# Altium project Grabber_DIOT.PrjPCB (part 1 of 2)
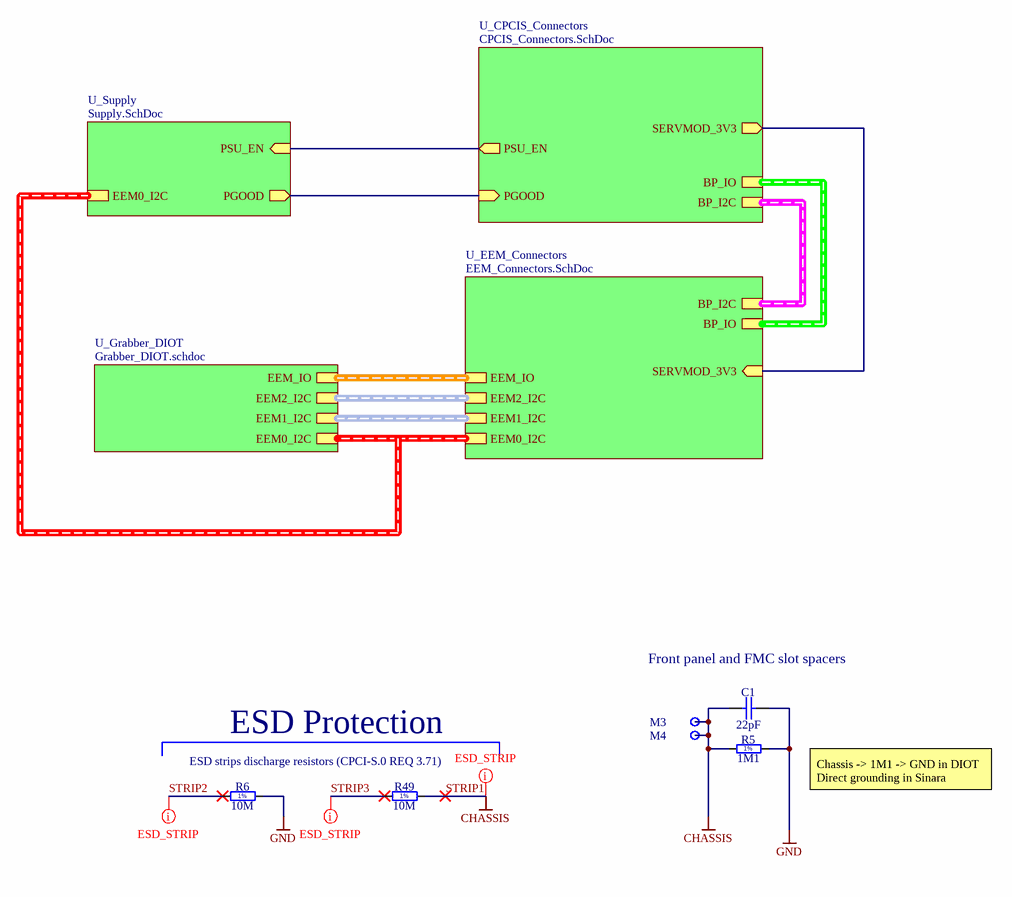
[diagram p0: Grabber_DIOT_TOP.SchDoc]
P_version: 0.1
6 sheets, 234 parts. Net scope: hierarchical (ports join the sheet entries above them; power ports are global).
Board file: Grabber_DIOT.PCBDOC
Sheets:
  Grabber_DIOT_TOP.SchDoc
    U_Grabber_DIOT = Grabber_DIOT.schdoc
      U_LVDS_repeater = LVDS_repeater.SchDoc
      U_LVDS_repeater = LVDS_repeater.SchDoc
      U_LVDS_repeater = LVDS_repeater.SchDoc
      U_LVDS_repeater = LVDS_repeater.SchDoc
      U_LVDS_repeater = LVDS_repeater.SchDoc
      U_LVDS_repeater = LVDS_repeater.SchDoc
      U_LVDS_repeater = LVDS_repeater.SchDoc
      U_LVDS_repeater = LVDS_repeater.SchDoc
      U_LVDS_repeater = LVDS_repeater.SchDoc
      U_LVDS_repeater = LVDS_repeater.SchDoc
      U_LVDS_repeater = LVDS_repeater.SchDoc
      U_LVDS_repeater = LVDS_repeater.SchDoc
      U_LVDS_repeater = LVDS_repeater.SchDoc
      U_LVDS_repeater = LVDS_repeater.SchDoc
      U_LVDS_repeater = LVDS_repeater.SchDoc
      U_LVDS_repeater = LVDS_repeater.SchDoc
      U_LVDS_repeater = LVDS_repeater.SchDoc
      U_LVDS_repeater = LVDS_repeater.SchDoc
      U_LVDS_repeater = LVDS_repeater.SchDoc
      U_LVDS_repeater = LVDS_repeater.SchDoc
      U_LVDS_repeater = LVDS_repeater.SchDoc
    U_CPCIS_Connectors = CPCIS_Connectors.SchDoc
    U_EEM_Connectors = EEM_Connectors.SchDoc
    U_Supply = Supply.SchDoc

## Sheet Grabber_DIOT_TOP.SchDoc: Grabber_DIOT
size 420 x 297 mm; CompanyName: WUT; DrawnBy: MMroz; Organization: WUT; Address1: Warsaw Univeristy of Technology; Address2: Nowowiejska 15/19; Revision: 0.1; SheetNumber: 1; SheetTotal: 5; Title2: TOP

### Parts
C1  22pF  [CAPC1005X55N]
M3  Plated Hole  [MTG300_600]  (value not drawn)  (no BOM)
M4  Plated Hole  [MTG300_600]  (value not drawn)  (no BOM)
R5  1M1  [RESC2012X60N]
R6  10M  [RESC2113X55N]
R49  10M  [RESC2113X55N]

### Sub-sheets
U_CPCIS_Connectors = CPCIS_Connectors.SchDoc: BP_IO (harness BP_LVDS), BP_I2C (harness I2C), SERVMOD_3V3 (out), PSU_EN (out), PGOOD (in)
U_EEM_Connectors = EEM_Connectors.SchDoc: EEM_IO (harness EEM_LVDS), BP_IO (harness BP_LVDS), EEM0_I2C (harness I2C), EEM1_I2C (harness I2C), EEM2_I2C (harness I2C), SERVMOD_3V3 (in), BP_I2C (harness I2C)
U_Grabber_DIOT = Grabber_DIOT.schdoc: EEM_IO (harness EEM_LVDS), EEM0_I2C (harness I2C), EEM1_I2C (harness I2C), EEM2_I2C (harness I2C)
U_Supply = Supply.SchDoc: PSU_EN (in), PGOOD (out), EEM0_I2C (harness I2C)

### Nets
GND: C1.2 R5.2 R6.2
STRIP1: C1.1 M3.1 M4.1 R5.1 R49.2  [also labelled CHASSIS]
PGOOD: sheet U_CPCIS_Connectors/PGOOD, sheet U_Supply/PGOOD
PSU_EN: sheet U_CPCIS_Connectors/PSU_EN, sheet U_Supply/PSU_EN
SERVMOD_3V3: sheet U_CPCIS_Connectors/SERVMOD_3V3, sheet U_EEM_Connectors/SERVMOD_3V3
STRIP2: R6.1
STRIP3: R49.1

### Buses and harness runs
harness sheet U_CPCIS_Connectors/BP_I2C = sheet U_EEM_Connectors/BP_I2C
harness sheet U_CPCIS_Connectors/BP_IO = sheet U_EEM_Connectors/BP_IO
harness sheet U_EEM_Connectors/EEM0_I2C = sheet U_Grabber_DIOT/EEM0_I2C = sheet U_Supply/EEM0_I2C
harness sheet U_EEM_Connectors/EEM1_I2C = sheet U_Grabber_DIOT/EEM1_I2C
harness sheet U_EEM_Connectors/EEM2_I2C = sheet U_Grabber_DIOT/EEM2_I2C
harness sheet U_EEM_Connectors/EEM_IO = sheet U_Grabber_DIOT/EEM_IO

### Layout directives
net class ESD_STRIP: STRIP1, STRIP2, STRIP3

### Notes on the sheet
- Front panel and FMC slot spacers
- ESD strips discharge resistors (CPCI-S.0 REQ 3.71)
- ESD Protection
- Chassis -> 1M1 -> GND in DIOT
  Direct grounding in Sinara
- Project/Equipment
- Document
- Designer
- Drawn by
- Check.by
- Copyright WUT ISE 2024.
  This documentation describes Open Hardware and is licensed under the CERN OHL v.2. You may redistribute and modify this documentation under the terms of the CERN OHL v.2. (http://ohwr.org/CERNOHL). This documentation is distributed WITHOUT ANY EXPRESS OR IMPLIED WARRANTY, INCLUDING OF MERCHANTABILITY, SATISFACTORY QUALITY AND FITNESS FOR A PARTICULAR PURPOSE. Please see the CERN OHL v.2 for applicable conditions.
- Contact
- File
- Last Mod.
- Print Date
- Sheet
- Size
- A3
- of
- Rev
- (in symbol R0805_1M1_1%_0.125W_100PPM) 1%
- (in symbol R0805_10M_1%_0.125W_100PPM_VISHAY_CRCW e3) 1%

### Library data of the parts
C1 = CC0402_22PF_50V_5%_C0G: Non-polarised capacitor; Part Description: SMD Multilayer Chip Ceramic Capacitor; Manufacturer: GENERIC; Manufacturer1 Part Number: C0402C220J5GACTU; Voltage: 50V; TC: C0G/NP0; Tolerance: ±5%; Part Number: CC0402_22PF_50V_5%_C0G; Component Kind: Standard; Component Type: Standard; Pin Count: 2; Value: 22pF; Status: Preferred; Manufacturer Part Number: CC0402_22PF_50V_5%_C0G; Case: 0402; Mounted: Yes; Socket: No; SMD: Yes; Manufacturer1 Example: KEMET; Manufacturer1 ComponentHeight: 0.55mm; HelpURL: \\cern.ch\dfs\Applications\Altium\Datasheets\CC0402_C0G_KEMET_(Commercial Grade).pdf; Author: CERN DEM JLC; CreateDate: 2007-12-03; LatestRevisionDate: 2007-12-03; Sense: No
M3 M4 = PLATED_HOLE3.0_PAD6.0: Single Terminal Socket; Part Description: Plated Through Hole: Hole Dia.=3.0mm Pad Dia.=6.0mm; Mounted: No; Table: Pads; Part Number: PLATED_HOLE3.0_PAD6.0; Component Type: Standard (No BOM); Designator: Single Terminal Socket; Library Reference: Single Terminal Socket; Pin Count: 1; Family: Plated Hole; Socket: No; SMD: No; Status: None; ComponentHeight: 0mm; Author: CERN DEM JLC; CreateDate: 26.05.2008; LatestRevisionDate: 26.05.2008; PackageDescription: Plated Through Hole: Hole Dia.=3.0mm Pad Dia.=6.0mm
R5 = R0805_1M1_1%_0.125W_100PPM: Resistor - 1%; Part Description: General Purpose Thick Film Chip Resistor; Manufacturer: GENERIC; Manufacturer1 Part Number: NRC10F1104TRF; PressFit: No; Part Number: R0805_1M1_1%_0.125W_100PPM; Component Kind: Standard; Component Type: Standard; Pin Count: 2; Value: 1M1; Status: Preferred; Manufacturer Part Number: R0805_1M1_1%_0.125W_100PPM; Case: 0805; Mounted: Yes; Sense: No; Socket: No; SMD: Yes; Manufacturer1 Example: NIC COMPONENT; Manufacturer1 ComponentHeight: 0.6mm; HelpURL: \\cern.ch\dfs\Applications\Altium\Datasheets\R0805_NIC_NRC.pdf; Author: CERN DEM JLC; CreateDate: 03/12/2007; LatestRevisionDate: 13/03/2008
R6 R49 = R0805_10M_1%_0.125W_100PPM_VISHAY_CRCW e3: 150V, Standard Thick Film Chip Resistor; Manufacturer: VISHAY DALE; Manufacturer Part Number: CRCW080510M0FKEA; Power: 0.125W; TC: ±100ppm/°C; Tolerance: ±1%; PressFit: No; Part Number: R0805_10M_1%_0.125W_100PPM; Component Kind: Standard; Component Type: Standard; Pin Count: 2; Value: 10M; Status: None; Part Description: 150V, Standard Thick Film Chip Resistor; Case: 0805; Mounted: Yes; Sense: No; Socket: No; SMD: Yes; ComponentHeight: 0.5mm; HelpURL: \\cern.ch\dfs\Applications\Altium\Datasheets\R0805_VISHAY_CRCW e3.pdf; Author: CERN DEM BC; CreateDate: 2019-11-12; LatestRevisionDate: 2019-11-12

## Sheet Grabber_DIOT.schdoc: Grabber_DIOT
size 420 x 297 mm; Author: G.K.; CompanyName: WUT; DrawnBy: G.K.; Organization: WUT; Address1: Warsaw Univeristy of Technology; Address2: Nowowiejska 15/19; DocumentNumber: 1; Revision: 0.1; SheetNumber: 2; SheetTotal: 5; EDA_Number: ARTIQ; Projet: ARTIQ/Sinara; ModifiedBy: -; CreateDate: -; CheckedDate: -; Title2: Extension board; DivGrp: ISE; Designer: G.K.; ModifiedDate: -; ProjectName: KASLI 3U subsystem
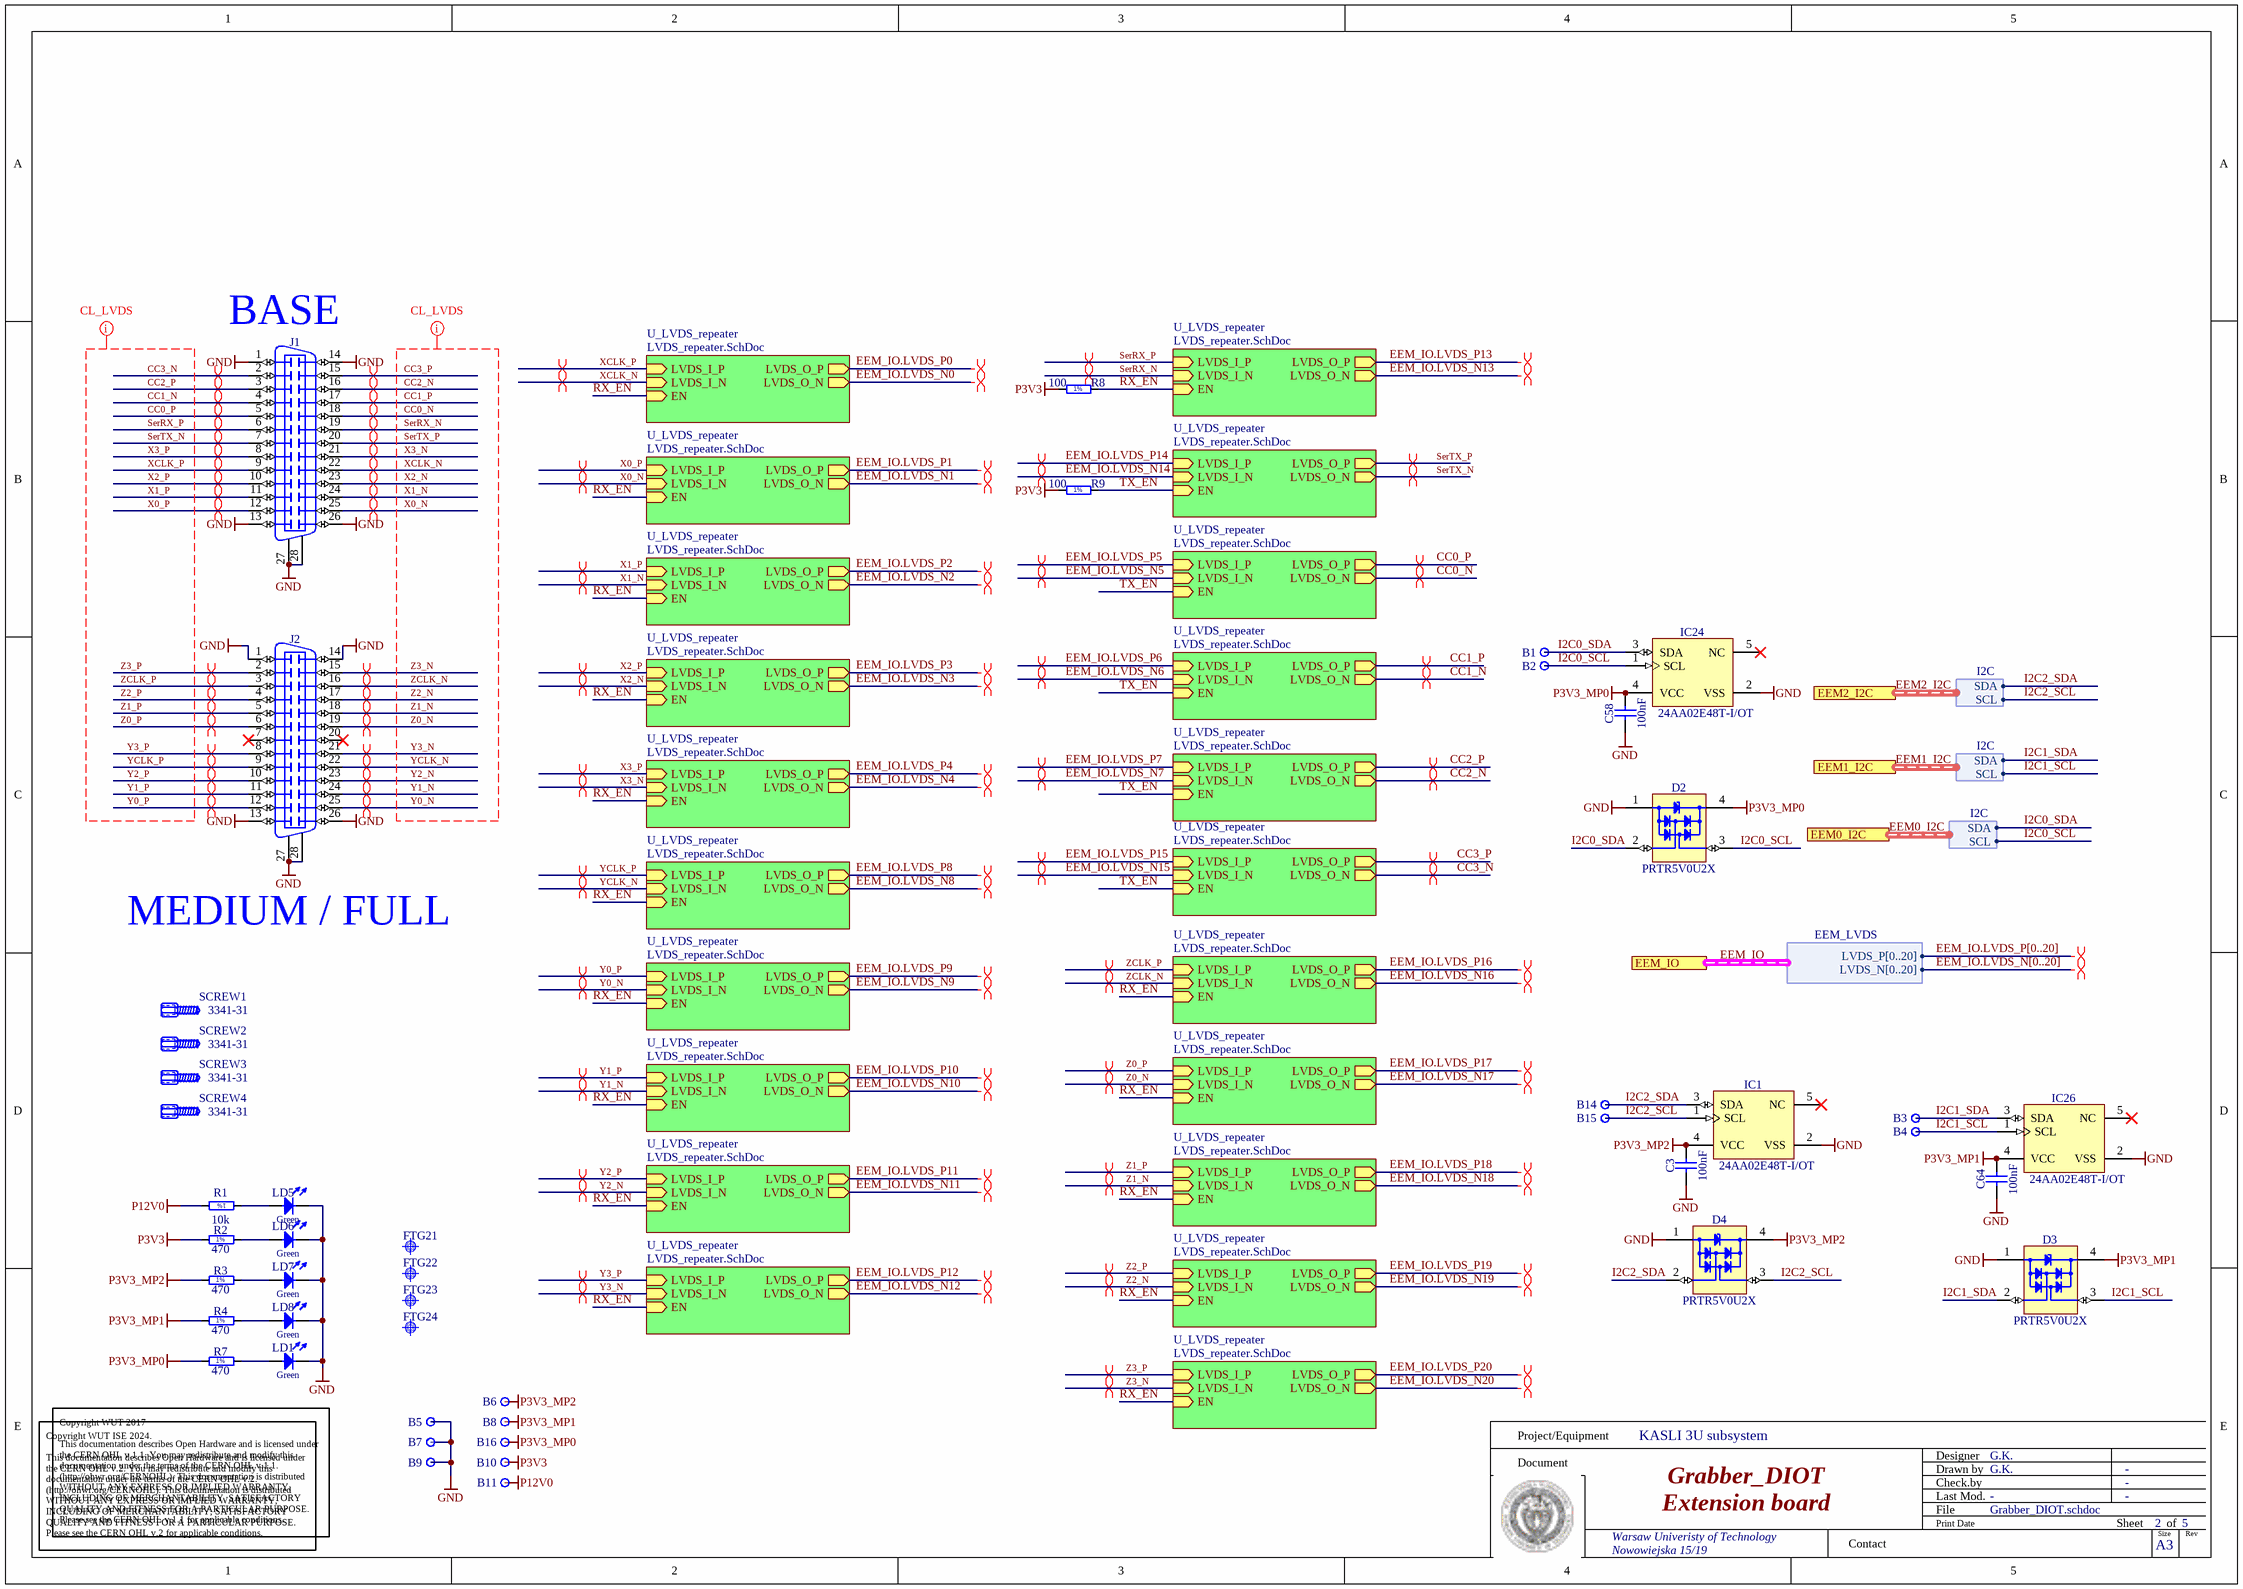
[diagram p1: Grabber_DIOT.schdoc]

### Parts
B1  Plated Hole  [c100h50]  (value not drawn)
B2  Plated Hole  [c100h50]  (value not drawn)
B3  Plated Hole  [c100h50]  (value not drawn)
B4  Plated Hole  [c100h50]  (value not drawn)
B5  Plated Hole  [c100h50]  (value not drawn)
B6  Plated Hole  [c100h50]  (value not drawn)
B7  Plated Hole  [c100h50]  (value not drawn)
B8  Plated Hole  [c100h50]  (value not drawn)
B9  Plated Hole  [c100h50]  (value not drawn)
B10  Plated Hole  [c100h50]  (value not drawn)
B11  Plated Hole  [c100h50]  (value not drawn)
B14  Plated Hole  [c100h50]  (value not drawn)
B15  Plated Hole  [c100h50]  (value not drawn)
B16  Plated Hole  [c100h50]  (value not drawn)
C3  100nF  [CAPC1005X55N]
C58  100nF  [CAPC1005X55N]
C64  100nF  [CAPC1005X55N]
D2  PRTR5V0U2X  [SOT190P230X110-4N]
D3  PRTR5V0U2X  [SOT190P230X110-4N]
D4  PRTR5V0U2X  [SOT190P230X110-4N]
FTG21  Use only in PCB  [FIDUCIAL_TOP_C100-200]  (value not drawn)
FTG22  Use only in PCB  [FIDUCIAL_TOP_S100-200]  (value not drawn)
FTG23  Use only in PCB  [FIDUCIAL_TOP_S200-400]  (value not drawn)
FTG24  Use only in PCB  [FIDUCIAL_TOP_S100-200]  (value not drawn)
IC1  24AA02E48T-I/OT  [SOT95P280X145-5N]
IC24  24AA02E48T-I/OT  [SOT95P280X145-5N]
IC26  24AA02E48T-I/OT  [SOT95P280X145-5N]
J1  N10226-5212PC  [3M_N10226-5212PC]  (value not drawn)
J2  N10226-5212PC  [3M_N10226-5212PC]  (value not drawn)
LD1  Green  [LED_KINGBRIGHT_KP-1608CGCK]  (value not drawn)
LD5  Green  [LED_KINGBRIGHT_KP-1608CGCK]  (value not drawn)
LD6  Green  [LED_KINGBRIGHT_KP-1608CGCK]  (value not drawn)
LD7  Green  [LED_KINGBRIGHT_KP-1608CGCK]  (value not drawn)
LD8  Green  [LED_KINGBRIGHT_KP-1608CGCK]  (value not drawn)
R1  10k  [RESC1005X40N]
R2  470  [RESC1005X40N]
R3  470  [RESC1005X40N]
R4  470  [RESC1005X40N]
R7  470  [RESC1005X40N]
R8  100  [RESC1005X40N]
R9  100  [RESC1005X40N]
SCREW1  3341-31  [3M_3341-31]
SCREW2  3341-31  [3M_3341-31]
SCREW3  3341-31  [3M_3341-31]
SCREW4  3341-31  [3M_3341-31]

### Sub-sheets
U_LVDS_repeater = LVDS_repeater.SchDoc: LVDS_I_P (in), LVDS_I_N (in), LVDS_O_P (out), LVDS_O_N (out), EN (in)
U_LVDS_repeater = LVDS_repeater.SchDoc: LVDS_I_P (in), LVDS_I_N (in), LVDS_O_P (out), LVDS_O_N (out), EN (in)
U_LVDS_repeater = LVDS_repeater.SchDoc: LVDS_I_P (in), LVDS_I_N (in), LVDS_O_P (out), LVDS_O_N (out), EN (in)
U_LVDS_repeater = LVDS_repeater.SchDoc: LVDS_I_P (in), LVDS_I_N (in), LVDS_O_P (out), LVDS_O_N (out), EN (in)
U_LVDS_repeater = LVDS_repeater.SchDoc: LVDS_I_P (in), LVDS_I_N (in), LVDS_O_P (out), LVDS_O_N (out), EN (in)
U_LVDS_repeater = LVDS_repeater.SchDoc: LVDS_I_P (in), LVDS_I_N (in), LVDS_O_P (out), LVDS_O_N (out), EN (in)
U_LVDS_repeater = LVDS_repeater.SchDoc: LVDS_I_P (in), LVDS_I_N (in), LVDS_O_P (out), LVDS_O_N (out), EN (in)
U_LVDS_repeater = LVDS_repeater.SchDoc: LVDS_I_P (in), LVDS_I_N (in), LVDS_O_P (out), LVDS_O_N (out), EN (in)
U_LVDS_repeater = LVDS_repeater.SchDoc: LVDS_I_P (in), LVDS_I_N (in), LVDS_O_P (out), LVDS_O_N (out), EN (in)
U_LVDS_repeater = LVDS_repeater.SchDoc: LVDS_I_P (in), LVDS_I_N (in), LVDS_O_P (out), LVDS_O_N (out), EN (in)
U_LVDS_repeater = LVDS_repeater.SchDoc: LVDS_I_P (in), LVDS_I_N (in), LVDS_O_P (out), LVDS_O_N (out), EN (in)
U_LVDS_repeater = LVDS_repeater.SchDoc: LVDS_I_P (in), LVDS_I_N (in), LVDS_O_P (out), LVDS_O_N (out), EN (in)
U_LVDS_repeater = LVDS_repeater.SchDoc: LVDS_I_P (in), LVDS_I_N (in), LVDS_O_P (out), LVDS_O_N (out), EN (in)
U_LVDS_repeater = LVDS_repeater.SchDoc: LVDS_I_P (in), LVDS_I_N (in), LVDS_O_P (out), LVDS_O_N (out), EN (in)
U_LVDS_repeater = LVDS_repeater.SchDoc: LVDS_I_P (in), LVDS_I_N (in), LVDS_O_P (out), LVDS_O_N (out), EN (in)
U_LVDS_repeater = LVDS_repeater.SchDoc: LVDS_I_P (in), LVDS_I_N (in), LVDS_O_P (out), LVDS_O_N (out), EN (in)
U_LVDS_repeater = LVDS_repeater.SchDoc: LVDS_I_P (in), LVDS_I_N (in), LVDS_O_P (out), LVDS_O_N (out), EN (in)
U_LVDS_repeater = LVDS_repeater.SchDoc: LVDS_I_P (in), LVDS_I_N (in), LVDS_O_P (out), LVDS_O_N (out), EN (in)
U_LVDS_repeater = LVDS_repeater.SchDoc: LVDS_I_P (in), LVDS_I_N (in), LVDS_O_P (out), LVDS_O_N (out), EN (in)
U_LVDS_repeater = LVDS_repeater.SchDoc: LVDS_I_P (in), LVDS_I_N (in), LVDS_O_P (out), LVDS_O_N (out), EN (in)
U_LVDS_repeater = LVDS_repeater.SchDoc: LVDS_I_P (in), LVDS_I_N (in), LVDS_O_P (out), LVDS_O_N (out), EN (in)

### Ports
EEM0_I2C (harness I2C), EEM1_I2C (harness I2C), EEM2_I2C (harness I2C), EEM_IO (harness EEM_LVDS)

### Harnesses
EEM_LVDS: LVDS_P[0..20], LVDS_N[0..20]
I2C: SDA, SCL

### Nets
GND: B5.1 B7.1 B9.1 C3.1 C58.1 C64.1 D2.1(GND) D3.1(GND) D4.1(GND) IC1.2(VSS) IC24.2(VSS) IC26.2(VSS) J1.1 J1.13 J1.14 J1.26 J1.27 J1.28 J2.1 J2.13 J2.14 J2.26 J2.27 J2.28 LD1.1(C) LD5.1(C) LD6.1(C) LD7.1(C) LD8.1(C)
P3V3: B10.1 R2.1 R8.1 R9.1
P3V3_MP0: B16.1 C58.2 D2.4(VCC) IC24.4(VCC) R7.1
P3V3_MP1: B8.1 C64.2 D3.4(VCC) IC26.4(VCC) R4.1
P3V3_MP2: B6.1 C3.2 D4.4(VCC) IC1.4(VCC) R3.1
P12V0: B11.1 R1.2
CC0_N: J1.18 ; sheet U_LVDS_repeater/LVDS_O_N
CC0_P: J1.5 ; sheet U_LVDS_repeater/LVDS_O_P
CC1_N: J1.4 ; sheet U_LVDS_repeater/LVDS_O_N
CC1_P: J1.17 ; sheet U_LVDS_repeater/LVDS_O_P
CC2_N: J1.16 ; sheet U_LVDS_repeater/LVDS_O_N
CC2_P: J1.3 ; sheet U_LVDS_repeater/LVDS_O_P
CC3_N: J1.2 ; sheet U_LVDS_repeater/LVDS_O_N
CC3_P: J1.15 ; sheet U_LVDS_repeater/LVDS_O_P
I2C0_SCL: B2.1 D2.3(I/O2) IC24.1(SCL) ; port EEM0_I2C.SCL  [project net EEM0_I2C.SCL]
I2C0_SDA: B1.1 D2.2(I/O1) IC24.3(SDA) ; port EEM0_I2C.SDA  [project net EEM0_I2C.SDA]
I2C1_SCL: B4.1 D3.3(I/O2) IC26.1(SCL) ; port EEM1_I2C.SCL  [project net EEM1_I2C.SCL]
I2C1_SDA: B3.1 D3.2(I/O1) IC26.3(SDA) ; port EEM1_I2C.SDA  [project net EEM1_I2C.SDA]
I2C2_SCL: B15.1 D4.3(I/O2) IC1.1(SCL) ; port EEM2_I2C.SCL  [project net EEM2_I2C.SCL]
I2C2_SDA: B14.1 D4.2(I/O1) IC1.3(SDA) ; port EEM2_I2C.SDA  [project net EEM2_I2C.SDA]
RX_EN: R8.2 ; sheet U_LVDS_repeater/EN, sheet U_LVDS_repeater/EN, sheet U_LVDS_repeater/EN, sheet U_LVDS_repeater/EN, sheet U_LVDS_repeater/EN, sheet U_LVDS_repeater/EN, sheet U_LVDS_repeater/EN, sheet U_LVDS_repeater/EN, sheet U_LVDS_repeater/EN, sheet U_LVDS_repeater/EN, sheet U_LVDS_repeater/EN, sheet U_LVDS_repeater/EN, sheet U_LVDS_repeater/EN, sheet U_LVDS_repeater/EN, sheet U_LVDS_repeater/EN, sheet U_LVDS_repeater/EN
SerRX_N: J1.19 ; sheet U_LVDS_repeater/LVDS_I_N
SerRX_P: J1.6 ; sheet U_LVDS_repeater/LVDS_I_P
SerTX_N: J1.7 ; sheet U_LVDS_repeater/LVDS_O_N
SerTX_P: J1.20 ; sheet U_LVDS_repeater/LVDS_O_P
TX_EN: R9.2 ; sheet U_LVDS_repeater/EN, sheet U_LVDS_repeater/EN, sheet U_LVDS_repeater/EN, sheet U_LVDS_repeater/EN, sheet U_LVDS_repeater/EN
X0_N: J1.25 ; sheet U_LVDS_repeater/LVDS_I_N
X0_P: J1.12 ; sheet U_LVDS_repeater/LVDS_I_P
X1_N: J1.24 ; sheet U_LVDS_repeater/LVDS_I_N
X1_P: J1.11 ; sheet U_LVDS_repeater/LVDS_I_P
X2_N: J1.23 ; sheet U_LVDS_repeater/LVDS_I_N
X2_P: J1.10 ; sheet U_LVDS_repeater/LVDS_I_P
X3_N: J1.21 ; sheet U_LVDS_repeater/LVDS_I_N
X3_P: J1.8 ; sheet U_LVDS_repeater/LVDS_I_P
XCLK_N: J1.22 ; sheet U_LVDS_repeater/LVDS_I_N
XCLK_P: J1.9 ; sheet U_LVDS_repeater/LVDS_I_P
Y0_N: J2.25 ; sheet U_LVDS_repeater/LVDS_I_N
Y0_P: J2.12 ; sheet U_LVDS_repeater/LVDS_I_P
Y1_N: J2.24 ; sheet U_LVDS_repeater/LVDS_I_N
Y1_P: J2.11 ; sheet U_LVDS_repeater/LVDS_I_P
Y2_N: J2.23 ; sheet U_LVDS_repeater/LVDS_I_N
Y2_P: J2.10 ; sheet U_LVDS_repeater/LVDS_I_P
Y3_N: J2.21 ; sheet U_LVDS_repeater/LVDS_I_N
Y3_P: J2.8 ; sheet U_LVDS_repeater/LVDS_I_P
YCLK_N: J2.22 ; sheet U_LVDS_repeater/LVDS_I_N
YCLK_P: J2.9 ; sheet U_LVDS_repeater/LVDS_I_P
Z0_N: J2.19 ; sheet U_LVDS_repeater/LVDS_I_N
Z0_P: J2.6 ; sheet U_LVDS_repeater/LVDS_I_P
Z1_N: J2.18 ; sheet U_LVDS_repeater/LVDS_I_N
Z1_P: J2.5 ; sheet U_LVDS_repeater/LVDS_I_P
Z2_N: J2.17 ; sheet U_LVDS_repeater/LVDS_I_N
Z2_P: J2.4 ; sheet U_LVDS_repeater/LVDS_I_P
Z3_N: J2.15 ; sheet U_LVDS_repeater/LVDS_I_N
Z3_P: J2.2 ; sheet U_LVDS_repeater/LVDS_I_P
ZCLK_N: J2.16 ; sheet U_LVDS_repeater/LVDS_I_N
ZCLK_P: J2.3 ; sheet U_LVDS_repeater/LVDS_I_P
NetLD1_2: LD1.2(A) R7.2
NetLD5_2: LD5.2(A) R1.1
NetLD6_2: LD6.2(A) R2.2
NetLD7_2: LD7.2(A) R3.2
NetLD8_2: LD8.2(A) R4.2

Not connected (* = marked no-connect by the designer): IC1 5(NC)*; IC24 5(NC)*; IC26 5(NC)*; J2 7* 20*

### Buses and harness runs
bus EEM_IO.LVDS_N[0..20]
bus EEM_IO.LVDS_P[0..20]
harness EEM0_I2C = port EEM0_I2C
harness EEM1_I2C = port EEM1_I2C
harness EEM2_I2C = port EEM2_I2C
harness EEM_IO = port EEM_IO

### Layout directives
differential pair: CC0_N, CC0_P, CC1_N, CC1_P, CC2_N, CC2_P, CC3_N, CC3_P, EEM_IO.LVDS_N0, EEM_IO.LVDS_N1, EEM_IO.LVDS_N2, EEM_IO.LVDS_N3, EEM_IO.LVDS_N4, EEM_IO.LVDS_N5, EEM_IO.LVDS_N6, EEM_IO.LVDS_N7, EEM_IO.LVDS_N8, EEM_IO.LVDS_N9, EEM_IO.LVDS_N10, EEM_IO.LVDS_N11, EEM_IO.LVDS_N12, EEM_IO.LVDS_N13, EEM_IO.LVDS_N14, EEM_IO.LVDS_N15, EEM_IO.LVDS_N16, EEM_IO.LVDS_N17, EEM_IO.LVDS_N18, EEM_IO.LVDS_N19, EEM_IO.LVDS_N20, EEM_IO.LVDS_P0, EEM_IO.LVDS_P1, EEM_IO.LVDS_P2, EEM_IO.LVDS_P3, EEM_IO.LVDS_P4, EEM_IO.LVDS_P5, EEM_IO.LVDS_P6, EEM_IO.LVDS_P7, EEM_IO.LVDS_P8, EEM_IO.LVDS_P9, EEM_IO.LVDS_P10, EEM_IO.LVDS_P11, EEM_IO.LVDS_P12, EEM_IO.LVDS_P13, EEM_IO.LVDS_P14, EEM_IO.LVDS_P15, EEM_IO.LVDS_P16, EEM_IO.LVDS_P17, EEM_IO.LVDS_P18, EEM_IO.LVDS_P19, EEM_IO.LVDS_P20, SerRX_N, SerRX_P, SerTX_N, SerTX_P, X0_N, X0_P, X1_N, X1_P, X2_N, X2_P, X3_N, X3_P, XCLK_N, XCLK_P, Y0_N, Y0_P, Y1_N, Y1_P, Y2_N, Y2_P, Y3_N, Y3_P, YCLK_N, YCLK_P, Z0_N, Z0_P, Z1_N, Z1_P, Z2_N, Z2_P, Z3_N, Z3_P, ZCLK_N, ZCLK_P
net class CL_LVDS: CC0_N, CC0_P, CC1_N, CC1_P, CC2_N, CC2_P, CC3_N, CC3_P, SerRX_N, SerRX_P, SerTX_N, SerTX_P, X0_N, X0_P, X1_N, X1_P, X2_N, X2_P, X3_N, X3_P, XCLK_N, XCLK_P, Y0_N, Y0_P, Y1_N, Y1_P, Y2_N, Y2_P, Y3_N, Y3_P, YCLK_N, YCLK_P, Z0_N, Z0_P, Z1_N, Z1_P, Z2_N, Z2_P, Z3_N, Z3_P, ZCLK_N, ZCLK_P
differential pair; differential pair class Diff_100Ohm: (no net found under the mark)

### Notes on the sheet
- (near J1) BASE
- MEDIUM / FULL
- Copyright WUT 2017
  This documentation describes Open Hardware and is licensed under the CERN OHL v.1.1. You may redistribute and modify this documentation under the terms of the CERN OHL v.1.1. (http://ohwr.org/CERNOHL). This documentation is distributed WITHOUT ANY EXPRESS OR IMPLIED WARRANTY, INCLUDING OF MERCHANTABILITY, SATISFACTORY QUALITY AND FITNESS FOR A PARTICULAR PURPOSE. Please see the CERN OHL v.1.1 for applicable conditions.
- Project/Equipment
- Document
- Designer
- Drawn by
- Check.by
- Copyright WUT ISE 2024.
  This documentation describes Open Hardware and is licensed under the CERN OHL v.2. You may redistribute and modify this documentation under the terms of the CERN OHL v.2. (http://ohwr.org/CERNOHL). This documentation is distributed WITHOUT ANY EXPRESS OR IMPLIED WARRANTY, INCLUDING OF MERCHANTABILITY, SATISFACTORY QUALITY AND FITNESS FOR A PARTICULAR PURPOSE. Please see the CERN OHL v.2 for applicable conditions.
- Contact
- File
- Last Mod.
- Print Date
- Sheet
- Size
- A3
- of
- Rev
- (in symbol R0402_10K_1%_0.0625W_100PPM) 1%
- (in symbol R0402_100R_1%_0.1W_100PPM) 1%
- (in symbol R0402_470R_1%_0.0625W_100PPM) 1%

### Library data of the parts
B1-B11 B14-B16 = PLATED_HOLE0.6_PAD1.3: Single Terminal Socket; Part Description: Plated Through Hole: Hole Dia.=0.6mm Pad Dia.=1.3mm; Mounted: No; Part Number: PLATED_HOLE0.6_PAD1.3; Component Kind: Standard (No BOM); Component Type: Standard (No BOM); Footprint: c130h60; Pin Count: 1; Family: Plated Hole; Socket: No; SMD: No; Sense: No; Status: None; ComponentHeight: 0mm; HelpURL: Undefined; Author: CERN DEM MR; CreateDate: 02.03.2016; LatestRevisionDate: 02.03.2016; PackageDescription: Plated Through Hole: Hole Dia.=0.6mm Pad Dia.=1.3mm
C3 C58 C64 = CC0402_100NF_16V_10%_X5R: Non-polarised capacitor; Part Description: SMD Multilayer Chip Ceramic Capacitor; Manufacturer: GENERIC; Manufacturer1 Part Number: GRM155R61C104KA88D; Voltage: 16V; TC: X5R; Tolerance: ±10%; Part Number: CC0402_100NF_16V_10%_X5R; Component Kind: Standard; Component Type: Standard; Pin Count: 2; Value: 100nF; Status: None; Manufacturer Part Number: CC0402_100NF_16V_10%_X5R; Case: 0402; Mounted: Yes; Socket: No; SMD: Yes; Sense: No; Manufacturer1 Example: MURATA; Manufacturer1 ComponentHeight: 0.55mm; HelpURL: \\cern.ch\dfs\Applications\Altium\Datasheets\CC0402_X5R_MURATA_GRM.pdf; Author: CERN DEM JLC; CreateDate: 10.12.2013; LatestRevisionDate: 10.12.2013
D2-D4 = PRTR5V0U2X: Ultra Low Capacitance Double Rail-to-Rail ESD Protection Diode; Part Description: Ultra Low Capacitance (1pF) Double Rail-to-Rail ESD Protection Diode (8kV); Manufacturer: NXP SEMICONDUCTORS; Voltage: 5.5V; PressFit: No; Bonding: No; Part Number: PRTR5V0U2X; Component Kind: Standard; Component Type: Standard; Device: PRTR5V0U2X; PackageDescription: SOT143B, SOT, 1.90mm Pitch; 4 Pin, 1.30mm W X 2.90mm L X 1.10mm H body, IPC Medium Density; Manufacturer Part Number: PRTR5V0U2X; Pin Count: 4; Case: SOT143B; Mounted: Yes; Socket: No; SMD: Yes; Sense: No; ComponentHeight: 1.1mm; HelpURL: \\cern.ch\dfs\Applications\Altium\Datasheets\PRTR5V0U2X.pdf; Author: CERN DEM JLC; CreateDate: 22.03.2011; LatestRevisionDate: 22.03.2011
FTG21 = FIDUCIAL_TARGET_C100-200: Fiducial Target; Part Description: Round Fiducial Target, Top Layer, 1.0mm, Top Solder 2.0mm, Keepout =2.0mm; Mounted: No; Part Number: FIDUCIAL_TARGET_C100-200; Component Kind: Standard (No BOM); Component Type: Standard (No BOM); Pin Count: 1; Family: Fiducial; Socket: No; SMD: Yes; Sense: No; Status: None; ComponentHeight: 0mm; HelpURL: Undefined; Author: CERN DEM JLC; CreateDate: 09.02.2010; LatestRevisionDate: 04.04.2012; PackageDescription: Round Fiducial Target, Top Layer, 1.0mm, Top Solder 2.0mm, Keepout =2.0mm
FTG22 FTG24 = FIDUCIAL_TARGET_S100-200: Fiducial Target; Part Description: Square Fiducial Target, Top Layer, 1.0mm, Top Solder 2.0mm, Keepout =2.0mm; Mounted: No; Part Number: FIDUCIAL_TARGET_S100-200; Component Kind: Standard (No BOM); Component Type: Standard (No BOM); Pin Count: 1; Family: Fiducial; Socket: No; SMD: Yes; Sense: No; Status: None; ComponentHeight: 0mm; HelpURL: Undefined; Author: CERN DEM JLC; CreateDate: 09.02.2010; LatestRevisionDate: 04.04.2012; PackageDescription: Square Fiducial Target, Top Layer, 1.0mm, Top Solder 2.0mm, Keepout =2.0mm
FTG23 = FIDUCIAL_TARGET_S200-400: Fiducial Target; Part Description: Square Fiducial Target, Top Layer, 2.0mm, Top Solder 4.0mm, Keepout =4.0mm; Mounted: No; Part Number: FIDUCIAL_TARGET_S200-400; Component Kind: Standard (No BOM); Component Type: Standard (No BOM); Pin Count: 1; Family: Fiducial; Socket: No; SMD: Yes; Sense: No; Status: None; ComponentHeight: 0mm; HelpURL: Undefined; Author: CERN DEM JLC; CreateDate: 02.06.2008; LatestRevisionDate: 04.04.2012; PackageDescription: Square Fiducial Target, Top Layer, 2.0mm, Top Solder 4.0mm, Keepout =4.0mm
IC1 IC24 IC26 = 24AA02E48T-I/OT: 1.7V-5.5V, 2K I2C Serial EEPROM With EUI-48 Node Identity; Manufacturer: MICROCHIP TECHNOLOGY; PressFit: No; Bonding: No; Part Number: 24AA02E48T-I/OT; Component Kind: Standard; Component Type: Standard; Device: 24AA02E48T-I/OT; PackageDescription: SOT, 0.95mm pitch; 5 pin, 1.60mm W X 2.90mm L X 1.45mm H body, IPC Medium Density; Part Description: 1.7V-5.5V, 2K I2C Serial EEPROM With EUI-48 Node Identity; Manufacturer Part Number: 24AA02E48T-I/OT; Pin Count: 5; Case: SOT23-5; Mounted: Yes; Socket: No; SMD: Yes; Sense: No; ComponentHeight: 1.45mm; HelpURL: \\cern.ch\dfs\Applications\Altium\Datasheets\24AA02E48T-I-OT.pdf; Author: CERN DEM MR; CreateDate: 31.03.2016; LatestRevisionDate: 31.03.2016
J1 J2 = 3M_N10226-5212PC: Connector Mini D Ribbon (MDR) 26 Female; Part Description: 26 contacts, Mini D Ribbon (MDR), .050" Boardmount Through-hole Right Angle Receptacle-Shielded, Diecast Body, 102 Series; Manufacturer: 3M; PressFit: No; Part Number: N10226-5212PC; Component Kind: Standard; Component Type: Standard; Footprint: MDR 26; Pin Count: 28; Family: MDR 26; Mounted: Yes; Socket: No; SMD: No; Sense: No; Status: None; Manufacturer Part Number: N10226-5212PC; ComponentHeight: 9.4mm; HelpURL: \\cern.ch\dfs\Applications\Altium\Datasheets\3M_N10226-5212PC.pdf; Author: CERN DEM JLC; CreateDate: 18.11.2008; LatestRevisionDate: 14.10.2009
LD1 LD5-LD8 = LED_KINGBRIGHT_KPH-1608CGCK: LED Green 1C 2A; Part Description: SMD Green LED, Case 1.6mmX0.8mm(0603), 0.65mm Thickness; PressFit: No; Bonding: No; Part Number: KPH-1608CGCK; Component Kind: Standard; Component Type: Standard; Color: Green; Footprint: LED_KINGBRIGHT_KPH-1608CGCK; PackageDescription: SMT Green LED, Case 0603, Body L 1.6 x W 0.8mm H 0.65mm; Manufacturer: KINGBRIGHT; Manufacturer Part Number: KPH-1608CGCK; Pin Count: 2; Mounted: Yes; Socket: No; SMD: Yes; Sense: No; ComponentHeight: 0.65mm; HelpURL: \\cern.ch\dfs\Applications\Altium\Datasheets\LED_KINGBRIGHT_KPH-1608CGCK.pdf; Author: CERN DEM JLC; CreateDate: 03.07.2017; LatestRevisionDate: 03.07.2017
R1 = R0402_10K_1%_0.0625W_100PPM: Resistor - 1%; Part Description: General Purpose Thick Film Chip Resistor; Manufacturer: GENERIC; Manufacturer1 Part Number: 232270671003L; TC: ±100ppm/°C; Part Number: R0402_10K_1%_0.0625W_100PPM; Component Kind: Standard; Component Type: Standard; Pin Count: 2; Value: 10k; Status: Not recommended; Power: 0.0625W; Tolerance: ±1%; Manufacturer Part Number: R0402_10K_1%_0.0625W_100PPM; Case: 0402; Mounted: Yes; Sense: No; Socket: No; SMD: Yes; Manufacturer1 Example: YAGEO PHYCOMP; Manufacturer1 ComponentHeight: 0.4mm; HelpURL: \\cern.ch\dfs\Applications\Altium\Datasheets\R0402_Phycomp_RC0402.pdf; Author: CERN DEM JLC; CreateDate: 03.12.2007; LatestRevisionDate: 17.10.2012
R2-R4 R7 = R0402_470R_1%_0.0625W_100PPM: Resistor - 1%; Part Description: General Purpose Thick Film Chip Resistor; Manufacturer: GENERIC; Manufacturer1 Part Number: 232270674701L; TC: ±100ppm/°C; PressFit: No; Part Number: R0402_470R_1%_0.0625W_100PPM; Component Kind: Standard; Component Type: Standard; Pin Count: 2; Value: 470; Status: Not Recommended; Power: 0.0625W; Tolerance: ±1%; Manufacturer Part Number: R0402_470R_1%_0.0625W_100PPM; Case: 0402; Mounted: Yes; Sense: No; Socket: No; SMD: Yes; Manufacturer1 Example: YAGEO PHYCOMP; Manufacturer1 ComponentHeight: 0.4mm; HelpURL: \\cern.ch\dfs\Applications\Altium\Datasheets\R0402_Phycomp_RC0402.pdf; Author: CERN DEM JLC; CreateDate: 03.12.2007; LatestRevisionDate: 17.10.2012
R8 R9 = R0402_100R_1%_0.1W_100PPM: Resistor - 1%; Part Description: General Purpose Thick Film Chip Resistor; Manufacturer: GENERIC; Manufacturer Part Number: R0402_100R_1%_0.1W_100PPM_50V; Manufacturer1 Part Number: ERJ2RKF1000X; Power: 0.1W; TC: ±100ppm/°C; Voltage: 50V; Part Number: R0402_100R_1%_0.1W_100PPM; Component Kind: Standard; Component Type: Standard; Pin Count: 2; Value: 100; Status: Not recommended; Tolerance: ±1%; Case: 0402; Mounted: Yes; Sense: No; Socket: No; SMD: Yes; Manufacturer1 Example: PANASONIC; Manufacturer1 ComponentHeight: 0.4mm; HelpURL: \\cern.ch\dfs\Applications\Altium\Datasheets\R0402_PANASONIC_ERJ2RK.pdf; Author: CERN DEM JLC; CreateDate: 12.12.2013; LatestRevisionDate: 03.03.2015
SCREW1-SCREW4 = MECH_MDR_screw_lock: VHDCI Female Screw Lock; Part Description: MDR Female Screw Locks, Thread Size: M2.5; Manufacturer: 3M; PressFit: No; Part Number: 3341-31; Component Kind: Standard; Component Type: Mechanical; Pin Count: 0; PackageDescription: MDR Female Screw Locks, Thread Size: M2.5; Mounted: Yes; Socket: No; SMD: No; Sense: No; Status: None; Value: 3341-31; Manufacturer Part Number: 3341-31; ComponentHeight: 5.48mm; HelpURL: \\cern.ch\dfs\Applications\Altium\Datasheets\TYCO_749087-2.pdf; Author: GK; CreateDate: 10.09.2013; LatestRevisionDate: 10.09.2013

## Sheet LVDS_repeater.SchDoc: SIngle channel
size 420 x 297 mm; Author: G.K.; CompanyName: WUT; DrawnBy: G.K.; Organization: CERN; Address1: Warsaw Univeristy of Technology; Address2: Nowowiejska 15/19; Revision: 0.1; SheetNumber: 3; SheetTotal: 5; EDA_Number: ARTIQ; Projet: Gerber; ModifiedBy: -; CreateDate: -; CheckedDate: -; Title2: LVDS repeater; DivGrp: ISE; Designer: G.K.; ModifiedDate: -; ProjectName: KASLI 3U subsystem
Used 21 times, as channels U_Grabber_DIOT/U_LVDS_repeater, U_Grabber_DIOT/U_LVDS_repeater, U_Grabber_DIOT/U_LVDS_repeater, U_Grabber_DIOT/U_LVDS_repeater, U_Grabber_DIOT/U_LVDS_repeater, U_Grabber_DIOT/U_LVDS_repeater, U_Grabber_DIOT/U_LVDS_repeater, U_Grabber_DIOT/U_LVDS_repeater, U_Grabber_DIOT/U_LVDS_repeater, U_Grabber_DIOT/U_LVDS_repeater, U_Grabber_DIOT/U_LVDS_repeater, U_Grabber_DIOT/U_LVDS_repeater, U_Grabber_DIOT/U_LVDS_repeater, U_Grabber_DIOT/U_LVDS_repeater, U_Grabber_DIOT/U_LVDS_repeater, U_Grabber_DIOT/U_LVDS_repeater, U_Grabber_DIOT/U_LVDS_repeater, U_Grabber_DIOT/U_LVDS_repeater, U_Grabber_DIOT/U_LVDS_repeater, U_Grabber_DIOT/U_LVDS_repeater, U_Grabber_DIOT/U_LVDS_repeater. Parts and nets are listed once, with the designators drawn on the sheet.
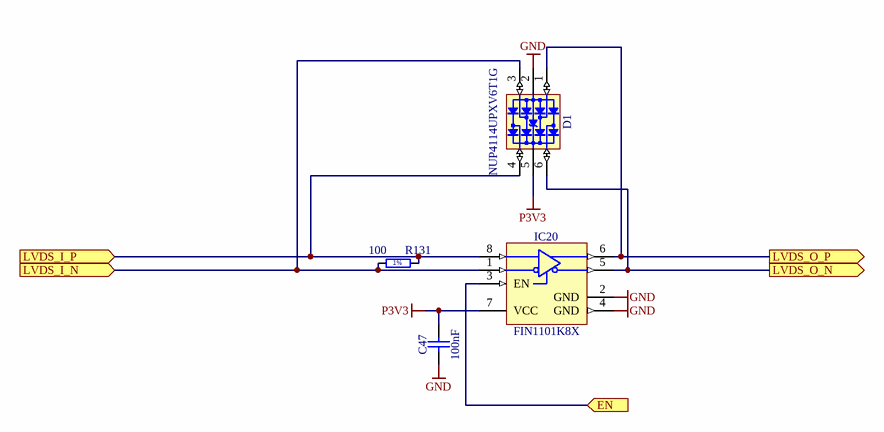
[diagram p2: LVDS_repeater.SchDoc]

### Parts
C47  100nF  [CAPC1005X55N]
D1  NUP4114UPXV6T1G  [SOTFL50P160X60-6N]
IC20  FIN1101K8X  [SOP50P310X90-8N]
R131  100  [RESC1005X40N]

### Ports
EN (in), LVDS_I_N (in), LVDS_I_P (in), LVDS_O_N (out), LVDS_O_P (out)

### Nets
GND: C47.1 D1.2(GND) IC20.2(GND) IC20.4(GND)
P3V3: C47.2 D1.5(VBUS) IC20.7(VCC)
EN: IC20.3(EN) ; port EN
LVDS_I_N: D1.3(I/O2) IC20.1(RIN-) R131.1 ; port LVDS_I_N
LVDS_I_P: D1.4(I/O3) IC20.8(RIN+) R131.2 ; port LVDS_I_P
LVDS_O_N: D1.6(I/O4) IC20.5(DOUT-) ; port LVDS_O_N
LVDS_O_P: D1.1(I/O1) IC20.6(DOUT+) ; port LVDS_O_P

### Channels
U_Grabber_DIOT/U_LVDS_repeater: designators end in U; ports EN=RX_EN LVDS_I_N=XCLK_N LVDS_I_P=XCLK_P LVDS_O_N=EEM_IO.LVDS_N0 LVDS_O_P=EEM_IO.LVDS_P0
U_Grabber_DIOT/U_LVDS_repeater: designators end in T; ports EN=RX_EN LVDS_I_N=X0_N LVDS_I_P=X0_P LVDS_O_N=EEM_IO.LVDS_N1 LVDS_O_P=EEM_IO.LVDS_P1
U_Grabber_DIOT/U_LVDS_repeater: designators end in S; ports EN=RX_EN LVDS_I_N=X1_N LVDS_I_P=X1_P LVDS_O_N=EEM_IO.LVDS_N2 LVDS_O_P=EEM_IO.LVDS_P2
U_Grabber_DIOT/U_LVDS_repeater: designators end in R; ports EN=RX_EN LVDS_I_N=X2_N LVDS_I_P=X2_P LVDS_O_N=EEM_IO.LVDS_N3 LVDS_O_P=EEM_IO.LVDS_P3
U_Grabber_DIOT/U_LVDS_repeater: designators end in Q; ports EN=RX_EN LVDS_I_N=X3_N LVDS_I_P=X3_P LVDS_O_N=EEM_IO.LVDS_N4 LVDS_O_P=EEM_IO.LVDS_P4
U_Grabber_DIOT/U_LVDS_repeater: designators end in P; ports EN=RX_EN LVDS_I_N=YCLK_N LVDS_I_P=YCLK_P LVDS_O_N=EEM_IO.LVDS_N8 LVDS_O_P=EEM_IO.LVDS_P8
U_Grabber_DIOT/U_LVDS_repeater: designators end in O; ports EN=RX_EN LVDS_I_N=Y0_N LVDS_I_P=Y0_P LVDS_O_N=EEM_IO.LVDS_N9 LVDS_O_P=EEM_IO.LVDS_P9
U_Grabber_DIOT/U_LVDS_repeater: designators end in N; ports EN=RX_EN LVDS_I_N=Y1_N LVDS_I_P=Y1_P LVDS_O_N=EEM_IO.LVDS_N10 LVDS_O_P=EEM_IO.LVDS_P10
U_Grabber_DIOT/U_LVDS_repeater: designators end in M; ports EN=RX_EN LVDS_I_N=Y2_N LVDS_I_P=Y2_P LVDS_O_N=EEM_IO.LVDS_N11 LVDS_O_P=EEM_IO.LVDS_P11
U_Grabber_DIOT/U_LVDS_repeater: designators end in L; ports EN=RX_EN LVDS_I_N=Y3_N LVDS_I_P=Y3_P LVDS_O_N=EEM_IO.LVDS_N12 LVDS_O_P=EEM_IO.LVDS_P12
U_Grabber_DIOT/U_LVDS_repeater: designators end in K; ports EN=RX_EN LVDS_I_N=SerRX_N LVDS_I_P=SerRX_P LVDS_O_N=EEM_IO.LVDS_N13 LVDS_O_P=EEM_IO.LVDS_P13
U_Grabber_DIOT/U_LVDS_repeater: designators end in J; ports EN=TX_EN LVDS_I_N=EEM_IO.LVDS_N14 LVDS_I_P=EEM_IO.LVDS_P14 LVDS_O_N=SerTX_N LVDS_O_P=SerTX_P
U_Grabber_DIOT/U_LVDS_repeater: designators end in I; ports EN=TX_EN LVDS_I_N=EEM_IO.LVDS_N5 LVDS_I_P=EEM_IO.LVDS_P5 LVDS_O_N=CC0_N LVDS_O_P=CC0_P
U_Grabber_DIOT/U_LVDS_repeater: designators end in H; ports EN=TX_EN LVDS_I_N=EEM_IO.LVDS_N6 LVDS_I_P=EEM_IO.LVDS_P6 LVDS_O_N=CC1_N LVDS_O_P=CC1_P
U_Grabber_DIOT/U_LVDS_repeater: designators end in G; ports EN=TX_EN LVDS_I_N=EEM_IO.LVDS_N7 LVDS_I_P=EEM_IO.LVDS_P7 LVDS_O_N=CC2_N LVDS_O_P=CC2_P
U_Grabber_DIOT/U_LVDS_repeater: designators end in F; ports EN=TX_EN LVDS_I_N=EEM_IO.LVDS_N15 LVDS_I_P=EEM_IO.LVDS_P15 LVDS_O_N=CC3_N LVDS_O_P=CC3_P
U_Grabber_DIOT/U_LVDS_repeater: designators end in E; ports EN=RX_EN LVDS_I_N=ZCLK_N LVDS_I_P=ZCLK_P LVDS_O_N=EEM_IO.LVDS_N16 LVDS_O_P=EEM_IO.LVDS_P16
U_Grabber_DIOT/U_LVDS_repeater: designators end in D; ports EN=RX_EN LVDS_I_N=Z0_N LVDS_I_P=Z0_P LVDS_O_N=EEM_IO.LVDS_N17 LVDS_O_P=EEM_IO.LVDS_P17
U_Grabber_DIOT/U_LVDS_repeater: designators end in C; ports EN=RX_EN LVDS_I_N=Z1_N LVDS_I_P=Z1_P LVDS_O_N=EEM_IO.LVDS_N18 LVDS_O_P=EEM_IO.LVDS_P18
U_Grabber_DIOT/U_LVDS_repeater: designators end in B; ports EN=RX_EN LVDS_I_N=Z2_N LVDS_I_P=Z2_P LVDS_O_N=EEM_IO.LVDS_N19 LVDS_O_P=EEM_IO.LVDS_P19
U_Grabber_DIOT/U_LVDS_repeater: designators end in A; ports EN=RX_EN LVDS_I_N=Z3_N LVDS_I_P=Z3_P LVDS_O_N=EEM_IO.LVDS_N20 LVDS_O_P=EEM_IO.LVDS_P20

### Notes on the sheet
- Project/Equipment
- Document
- Designer
- Drawn by
- Check.by
- Copyright WUT ISE 2024.
  This documentation describes Open Hardware and is licensed under the CERN OHL v.2. You may redistribute and modify this documentation under the terms of the CERN OHL v.2. (http://ohwr.org/CERNOHL). This documentation is distributed WITHOUT ANY EXPRESS OR IMPLIED WARRANTY, INCLUDING OF MERCHANTABILITY, SATISFACTORY QUALITY AND FITNESS FOR A PARTICULAR PURPOSE. Please see the CERN OHL v.2 for applicable conditions.
- Contact
- File
- Last Mod.
- Print Date
- Sheet
- Size
- A3
- of
- Rev
- (in symbol R0402_100R_1%_0.1W_100PPM) 1%

### Library data of the parts
C47 = CC0402_100NF_16V_10%_X5R: as C3 on sheet Grabber_DIOT; Part Number: CC0402_100NF_16V_10%_X5R; Component Kind: Standard; Component Type: Standard; Pin Count: 2; Value: 100nF; Status: None; Manufacturer Part Number: CC0402_100NF_16V_10%_X5R; Case: 0402; Mounted: Yes; Socket: No; SMD: Yes; Sense: No; Manufacturer1 Example: MURATA; Manufacturer1 ComponentHeight: 0.55mm; HelpURL: \\cern.ch\dfs\Applications\Altium\Datasheets\CC0402_X5R_MURATA_GRM.pdf; Author: CERN DEM JLC; CreateDate: 10.12.2013; LatestRevisionDate: 10.12.2013
D1 = NUP4114UPXV6T1G: ESD Protection Diodes Array (8kV) with Low Clamping Voltage; Manufacturer: ON SEMICONDUCTOR; Voltage: 5.5V; PressFit: No; Bonding: No; Part Number: NUP4114UPXV6T1G; Component Kind: Standard; Component Type: Standard; Device: NUP4114UPXV6T1G; PackageDescription: SOTFL (SOT666, SOT563,), 0.50mm, Pitch; 6 Pin, 1.20mm W X 1.60mm L X 0.60mm H Body, IPC Medium Density; Part Description: ESD Protection Diodes Array (8kV) with Low Clamping Voltage; Manufacturer Part Number: NUP4114UPXV6T1G; Pin Count: 8; Mounted: Yes; Socket: No; SMD: Yes; Sense: No; ComponentHeight: 1.75mm; HelpURL: \\cern.ch\dfs\Applications\Altium\Datasheets\NUP4114UPXV6T1G.pdf; Author: CERN DEM JLC; CreateDate: 05.12.2012; LatestRevisionDate: 05.12.2012
IC20 = FIN1101K8X: LVDS Single Port High Speed Repeater; Manufacturer: FAIRCHILD SEMICONDUCTOR; PressFit: No; Bonding: No; Part Number: FIN1101K8X; Component Kind: Standard; Component Type: Standard; Device: FIN1101K8X; PackageDescription: SOP, 0.50mm Pitch; 8 pin, 2.30mm W X 2.00mm L X 0.90mm H body, PC Medium Density; Part Description: LVDS Single Port High Speed Repeater; Manufacturer Part Number: FIN1101K8X; Pin Count: 8; Case: TSSOP8; Mounted: Yes; Socket: No; SMD: Yes; Sense: No; ComponentHeight: 0.8mm; Author: CERN DEM JLC; HelpURL: \\cern.ch\dfs\Applications\Altium\Datasheets\FIN1101K8X.pdf; CreateDate: 08.11.2016; LatestRevisionDate: 08.11.2016
R131 = R0402_100R_1%_0.1W_100PPM: as R8 on sheet Grabber_DIOT; Part Number: R0402_100R_1%_0.1W_100PPM; Component Kind: Standard; Component Type: Standard; Pin Count: 2; Value: 100; Status: Not recommended; Tolerance: ±1%; Case: 0402; Mounted: Yes; Sense: No; Socket: No; SMD: Yes; Manufacturer1 Example: PANASONIC; Manufacturer1 ComponentHeight: 0.4mm; HelpURL: \\cern.ch\dfs\Applications\Altium\Datasheets\R0402_PANASONIC_ERJ2RK.pdf; Author: CERN DEM JLC; CreateDate: 12.12.2013; LatestRevisionDate: 03.03.2015

## Sheet CPCIS_Connectors.SchDoc: Grabber_DIOT
size 420 x 297 mm; CompanyName: WUT; DrawnBy: MMroz; Organization: WUT; Address1: Warsaw Univeristy of Technology; Address2: Nowowiejska 15/19; Revision: 0.1; SheetNumber: 5; SheetTotal: 5; SPICEModelCacheRLGUJVSZ: <root> / <DocumentId>RLGUJVSZ</DocumentId> / </root>; Title2: CPCIS_Connectors
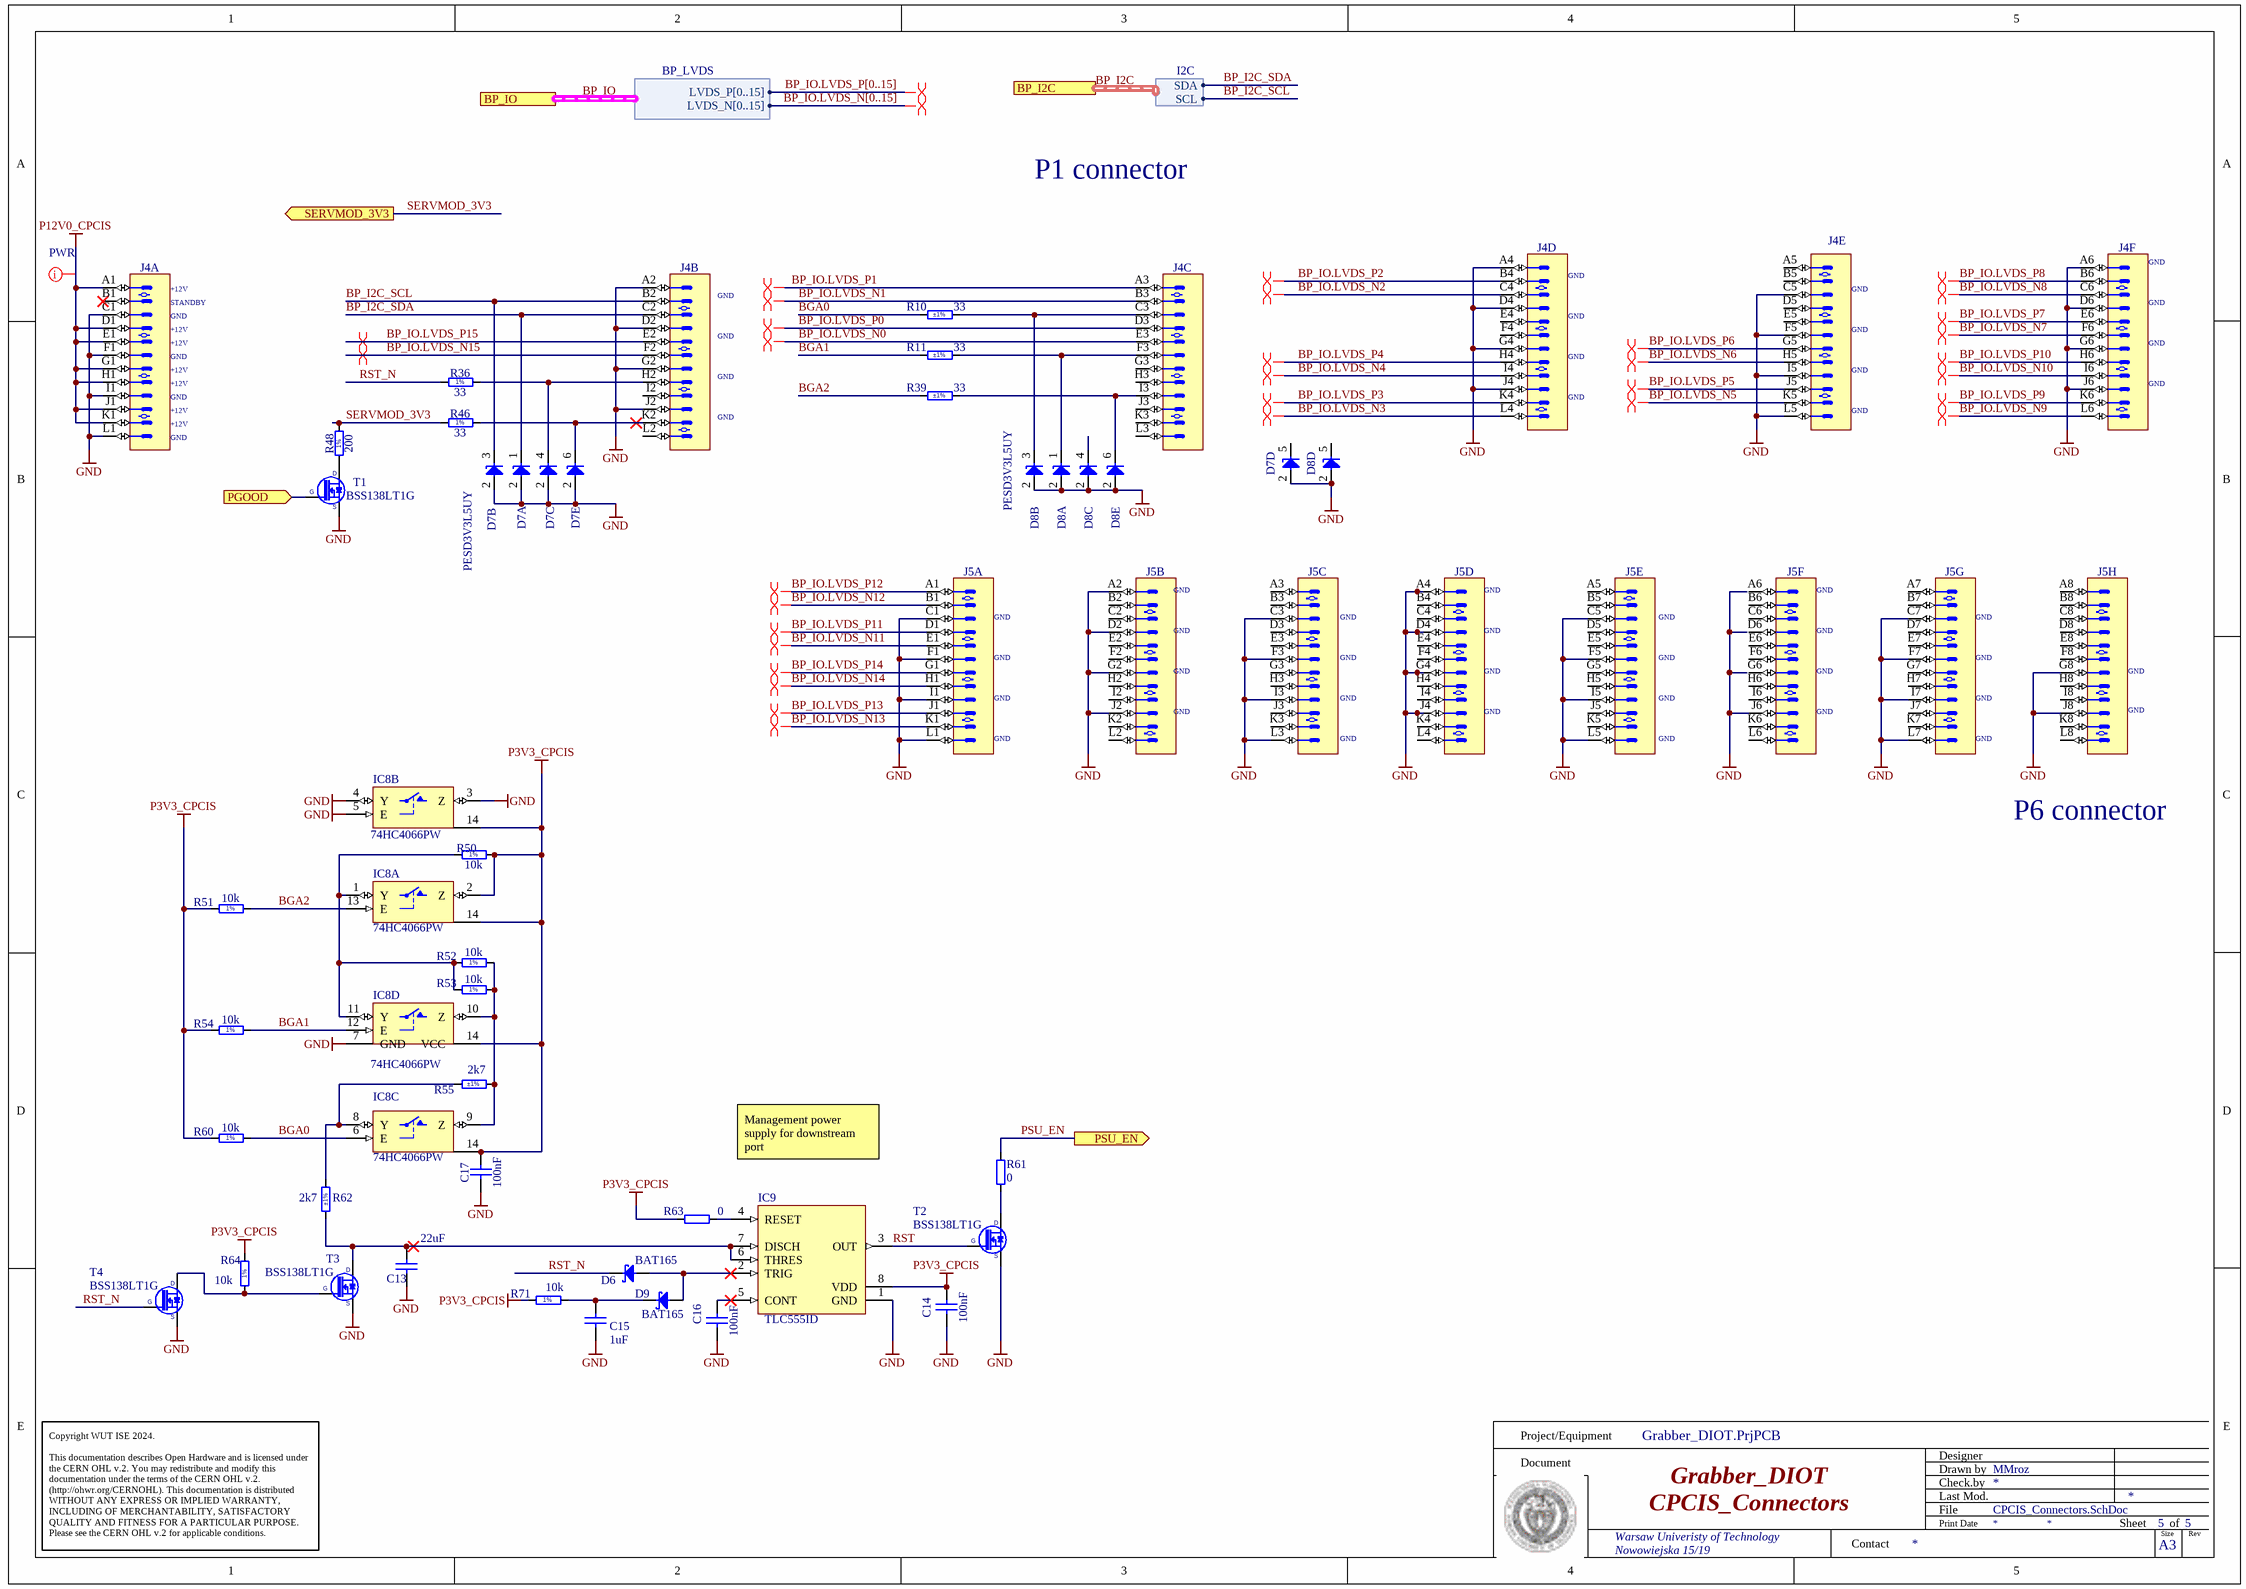
[diagram p3: CPCIS_Connectors.SchDoc]

### Parts
C13  22uF  [CAPC2012X135N]
C14  100nF  [CAPC1005X55N]
C15  1uF  [CAPC1608X87N]
C16  100nF  [CAPC1005X55N]
C17  100nF  [CAPC1005X55N]
D6  BAT165  [SOD2512X110N]
D7  PESD3V3L5UY  [SOT65P210X110-6N]  (value not drawn)  (parts A,B,C,D,E of 5)
D8  PESD3V3L5UY  [SOT65P210X110-6N]  (value not drawn)  (parts A,B,C,D,E of 5)
D9  BAT165  [SOD2512X110N]
IC8  74HC4066PW  [SOP65P640X110-14N]  (parts A,B,C,D of 4)
IC9  TLC555ID  [SOIC127P600X175-8N]
J4  10052825-101LF  [AMPHENOL_10052825-101LF]  (value not drawn)  (parts A,B,C,D,E,F of 6)
J5  10052838-101LF  [AMPHENOL_10052838-101LF]  (value not drawn)  (parts A,B,C,D,E,F,G,H of 8)
R10  33  Tolerance: ±1%  [RESC1608X55N]
R11  33  Tolerance: ±1%  [RESC1608X55N]
R36  33  Tolerance: 1%  [RESC1005X40N]
R39  33  Tolerance: ±1%  [RESC1608X55N]
R46  33  Tolerance: 1%  [RESC1005X40N]
R48  200  [RESC1005X40N]
R50  10k  [RESC1005X40N]
R51  10k  [RESC1005X40N]
R52  10k  [RESC1005X40N]
R53  10k  [RESC1005X40N]
R54  10k  [RESC1005X40N]
R55  2k7  Tolerance: ±1%  [RESC1608X55N]
R60  10k  [RESC1005X40N]
R61  0  [RESC1005X35N]
R62  2k7  Tolerance: ±1%  [RESC1608X55N]
R63  0  [RESC1005X35N]
R64  10k  [RESC1005X40N]
R71  10k  [RESC1005X40N]
T1  BSS138LT1G  [SOT95P240X110-3N]
T2  BSS138LT1G  [SOT95P240X110-3N]
T3  BSS138LT1G  [SOT95P240X110-3N]
T4  BSS138LT1G  [SOT95P240X110-3N]

### Ports
BP_I2C (harness I2C), BP_IO (harness BP_LVDS), PGOOD (in), PSU_EN (out), SERVMOD_3V3 (out)

### Harnesses
BP_LVDS: LVDS_P[0..15], LVDS_N[0..15]
I2C: SDA, SCL

### Nets
GND: C13.1 C14.1 C15.1 C16.1 C17.1 D7.2(A) D8.2(A) IC8.3(Z) IC8.4(Y) IC8.5(E) IC8.7(GND) IC9.1(GND) J4.A2 J4.A4 J4.A6 J4.C1 J4.C5 J4.D2 J4.D4 J4.D6 J4.F1 J4.F5 J4.G2 J4.G4 J4.G6 J4.I1 J4.I5 J4.J2 J4.J4 J4.J6 J4.L1 J4.L5 J5.A2 J5.A4 J5.C1 J5.C3 J5.C5 J5.C7 J5.D2 J5.D4 J5.F1 J5.F3 J5.F5 J5.F7 J5.G2 J5.G4 J5.G8 J5.I1 J5.I3 J5.I5 J5.I7 J5.J2 J5.J4 J5.J6 J5.J8 J5.L1 J5.L3 J5.L5 J5.L7 T1.2(S) T2.2(S) T3.2(S) T4.2(S)
P3V3_CPCIS: C14.2 C17.2 IC8.2(Z) IC8.14(VCC) IC9.8(VDD) R50.2 R51.1 R54.1 R60.1 R63.2 R64.2 R71.1
P12V0_CPCIS: J4.A1 J4.D1 J4.E1 J4.G1 J4.H1 J4.J1 J4.K1
BGA0: IC8.6(E) R10.2 R60.2
BGA1: IC8.12(E) R11.2 R54.2
BGA2: IC8.13(E) R39.2 R51.2
BP_I2C_SCL: D7.3(C) J4.B2 ; port BP_I2C.SCL  [project net BP_I2C.SCL]
BP_I2C_SDA: D7.1(C) J4.C2 ; port BP_I2C.SDA  [project net BP_I2C.SDA]
BP_IO.LVDS_N0: J4.E3
BP_IO.LVDS_N1: J4.B3
BP_IO.LVDS_N2: J4.C4
BP_IO.LVDS_N3: J4.L4
BP_IO.LVDS_N4: J4.I4
BP_IO.LVDS_N5: J4.K5
BP_IO.LVDS_N6: J4.H5
BP_IO.LVDS_N7: J4.F6
BP_IO.LVDS_N8: J4.C6
BP_IO.LVDS_N9: J4.L6
BP_IO.LVDS_N10: J4.I6
BP_IO.LVDS_N11: J5.E1
BP_IO.LVDS_N12: J5.B1
BP_IO.LVDS_N13: J5.K1
BP_IO.LVDS_N14: J5.H1
BP_IO.LVDS_N15: J4.F2
BP_IO.LVDS_P0: J4.D3
BP_IO.LVDS_P1: J4.A3
BP_IO.LVDS_P2: J4.B4
BP_IO.LVDS_P3: J4.K4
BP_IO.LVDS_P4: J4.H4
BP_IO.LVDS_P5: J4.J5
BP_IO.LVDS_P6: J4.G5
BP_IO.LVDS_P7: J4.E6
BP_IO.LVDS_P8: J4.B6
BP_IO.LVDS_P9: J4.K6
BP_IO.LVDS_P10: J4.H6
BP_IO.LVDS_P11: J5.D1
BP_IO.LVDS_P12: J5.A1
BP_IO.LVDS_P13: J5.J1
BP_IO.LVDS_P14: J5.G1
BP_IO.LVDS_P15: J4.E2
PGOOD: T1.1(G) ; port PGOOD
PSU_EN: R61.1 ; port PSU_EN
RST: IC9.3(OUT) T2.1(G)
RST_N: D6.1(C) R36.1 T4.1(G)
SERVMOD_3V3: R46.1 R48.2 ; port SERVMOD_3V3
NetC13_2: C13.2 IC9.6(THRES) IC9.7(DISCH) R62.2 T3.3(D)
NetC15_2: C15.2 D9.1(C) R71.2
NetC16_2: C16.2 IC9.5(CONT)
NetD6_2: D6.2(A) D9.2(A) IC9.2(TRIG)
NetD7_4: D7.4(C) J4.H2 R36.2
NetD7_6: D7.6(C) J4.K2 R46.2
NetD8_1: D8.1(C) J4.F3 R11.1
NetD8_3: D8.3(C) J4.C3 R10.1
NetD8_6: D8.6(C) J4.I3 R39.1
NetIC8_1: IC8.1(Y) IC8.11(Y) R50.1 R52.1 R53.1
NetIC8_8: IC8.8(Y) R55.1 R62.1
NetIC8_9: IC8.9(Z) IC8.10(Z) R52.2 R53.2 R55.2
NetIC9_4: IC9.4(RESET) R63.1
NetR48_1: R48.1 T1.3(D)
NetR61_2: R61.2 T2.3(D)
NetR64_1: R64.1 T3.1(G) T4.3(D)

Not connected (* = marked no-connect by the designer): D7 5(C); D8 4(C) 5(C); J4 A5 B1* B5 D5 E4 E5 F4 G3 H3 I2 J3 K3 L2 L3; J5 A3 A5 A6 A7 A8 B2 B3 B4 B5 B6 B7 B8 C2 C4 C6 C8 D3 D5 D6 D7 D8 E2 E3 E4 E5 E6 E7 E8 F2 F4 F6 F8 G3 G5 G6 G7 H2 H3 H4 H5 H6 H7 H8 I2 I4 I6 I8 J3 J5 J7 K2 K3 K4 K5 K6 K7 K8 L2 L4 L6 L8

### Buses and harness runs
bus BP_IO.LVDS_N[0..15]
bus BP_IO.LVDS_P[0..15]
harness BP_I2C = port BP_I2C
harness BP_IO = port BP_IO

### Layout directives
differential pair; differential pair class Diff_100Ohm: (no net found under the mark)
net class PWR: P12V0_CPCIS
differential pair: BP_IO.LVDS_N0, BP_IO.LVDS_N1, BP_IO.LVDS_N2, BP_IO.LVDS_N3, BP_IO.LVDS_N4, BP_IO.LVDS_N5, BP_IO.LVDS_N6, BP_IO.LVDS_N7, BP_IO.LVDS_N8, BP_IO.LVDS_N9, BP_IO.LVDS_N10, BP_IO.LVDS_N11, BP_IO.LVDS_N12, BP_IO.LVDS_N13, BP_IO.LVDS_N14, BP_IO.LVDS_N15, BP_IO.LVDS_P0, BP_IO.LVDS_P1, BP_IO.LVDS_P2, BP_IO.LVDS_P3, BP_IO.LVDS_P4, BP_IO.LVDS_P5, BP_IO.LVDS_P6, BP_IO.LVDS_P7, BP_IO.LVDS_P8, BP_IO.LVDS_P9, BP_IO.LVDS_P10, BP_IO.LVDS_P11, BP_IO.LVDS_P12, BP_IO.LVDS_P13, BP_IO.LVDS_P14, BP_IO.LVDS_P15

### Notes on the sheet
- P1 connector
- (near J4) GND
- (near J4) +12V
- (near J4) STANDBY
- (near J5) GND
- P6 connector
- Management power supply for downstream port
- Project/Equipment
- Document
- Designer
- Drawn by
- Check.by
- Copyright WUT ISE 2024.
  This documentation describes Open Hardware and is licensed under the CERN OHL v.2. You may redistribute and modify this documentation under the terms of the CERN OHL v.2. (http://ohwr.org/CERNOHL). This documentation is distributed WITHOUT ANY EXPRESS OR IMPLIED WARRANTY, INCLUDING OF MERCHANTABILITY, SATISFACTORY QUALITY AND FITNESS FOR A PARTICULAR PURPOSE. Please see the CERN OHL v.2 for applicable conditions.
- Contact
- File
- Last Mod.
- Print Date
- Sheet
- Size
- A3
- of
- Rev
- (in symbol R0402_10K_1%_0.0625W_100PPM) 1%
- (in symbol R0402_200R_1%_0.0625W_100PPM) 1%

### Library data of the parts
C13 = CC0805_22UF_16V_10%_X5R: Non-polarised capacitor; Part Description: SMD Multilayer Chip Ceramic Capacitor; Manufacturer: GENERIC; Manufacturer1 Part Number: C2012X5R1C226KT; Voltage: 16V; TC: X5R; Tolerance: ±10%; Part Number: CC0805_22UF_16V_10%_X5R; Component Kind: Standard; Component Type: Standard; Pin Count: 2; Value: 22uF; Status: Preferred; Manufacturer Part Number: CC0805_22UF_16V_10%_X5R; Case: 0805; Mounted: Yes; Socket: No; SMD: Yes; Sense: No; Manufacturer1 Example: TDK; Manufacturer1 ComponentHeight: 1.35mm; HelpURL: \\cern.ch\dfs\Applications\Altium\Datasheets\CC0805_X5R_TDK_C.pdf; Author: CERN DEM JLC; CreateDate: 25.10.2012; LatestRevisionDate: 25.10.2012
C14 C16 C17 = CC0402_100NF_16V_10%_X5R: as C3 on sheet Grabber_DIOT; Part Number: CC0402_100NF_16V_10%_X5R; Component Kind: Standard; Component Type: Standard; Pin Count: 2; Value: 100nF; Status: None; Manufacturer Part Number: CC0402_100NF_16V_10%_X5R; Case: 0402; Mounted: Yes; Socket: No; SMD: Yes; Sense: No; Manufacturer1 Example: MURATA; Manufacturer1 ComponentHeight: 0.55mm; HelpURL: \\cern.ch\dfs\Applications\Altium\Datasheets\CC0402_X5R_MURATA_GRM.pdf; Author: CERN DEM JLC; CreateDate: 10.12.2013; LatestRevisionDate: 10.12.2013
C15 = CC0603_1UF_16V_10%_X7R: Non-polarised capacitor; Part Description: SMD Multilayer Chip Ceramic Capacitor; Manufacturer: GENERIC; Manufacturer1 Part Number: 223878615663; Voltage: 16V; TC: X7R; Tolerance: ±10%; Part Number: CC0603_1UF_16V_10%_X7R; Component Kind: Standard; Component Type: Standard; Pin Count: 2; Value: 1uF; Status: None; Manufacturer Part Number: CC0603_1UF_16V_10%_X7R; Case: 0603; Mounted: Yes; Socket: No; SMD: Yes; Sense: No; Manufacturer1 Example: YAGEO PHYCOMP; Manufacturer1 ComponentHeight: 0.9mm; HelpURL: \\cern.ch\dfs\Applications\Altium\Datasheets\CC0603_X7R_PHYCOMP.pdf; Author: CERN DEM JLC; CreateDate: 03.12.2007; LatestRevisionDate: 17.04.2015
D6 D9 = BAT165: Schottky Diode; Manufacturer: INFINEON; Part Description: Medium Power AF Schottky Diode; Voltage: 40V; Power: 750mA; PressFit: No; Bonding: No; Manufacturer Part Number: BAT165; PackageDescription: Small Outline Diode (SOD-323), 1.70mm W X 1.25mm L X 1.10mm H body,  IPC Medium Density; Part Number: BAT165; Component Kind: Standard; Component Type: Standard; Device: BAT165; Pin Count: 2; Case: SOD323; Mounted: Yes; Socket: No; SMD: Yes; Sense: No; ComponentHeight: 1.1mm; HelpURL: \\cern.ch\dfs\Applications\Altium\Datasheets\BAT165.pdf; Author: CERN DEM JLC; CreateDate: 12.11.2014; LatestRevisionDate: 12.11.2014
D7 D8 = PESD3V3L5UY: Fivefold ESD Protection Diode Arrays; Part Description: Fivefold ESD Protection Diode Arrays (30kV); Manufacturer: NEXPERIA; Voltage: 3.3V; Power: 200W; PressFit: No; Bonding: No; Part Number: PESD3V3L5UY; Component Kind: Standard; Component Type: Standard; Device: PESD3V3L5UY; PackageDescription: SOT363, SC-88, 0.65mm Pitch; 6 Pin, 1.25mm W X 2.00mm L X 1.10mm H body, IPC Medium Density; Manufacturer Part Number: PESD3V3L5UY; Pin Count: 6; Case: SOT363; Mounted: Yes; Socket: No; SMD: Yes; Sense: No; ComponentHeight: 1.1mm; HelpURL: \\cern.ch\dfs\Applications\Altium\Datasheets\PESD3V3L5UY.pdf; Author: CERN DEM WB; CreateDate: 05.07.2021; LatestRevisionDate: 05.07.2021
IC8 = 74HC4066PW: Part Description: Quad Single-Pole Single-Throw Analog Switch; Manufacturer: NXP SEMICONDUCTORS; PressFit: No; Bonding: No; Table: Standard Logic; Part Number: 74HC4066PW; Component Kind: Standard; Component Type: Standard; Device: 74HC4066PW; PackageDescription: SOP, 14-Leads, Body 4.4x5mm (max), Pitch 0.65mm, IPC Medium Density; Manufacturer Part Number: 74HC4066PW; Pin Count: 14; Case: TSSOP14; Mounted: Yes; Socket: No; SMD: Yes; ComponentHeight: 1.1mm; Author: CERN DEM JLC; HelpURL: \\cern.ch\dfs\Applications\Altium\Datasheets\74HC4066PW.pdf; CreateDate: 2014-11-19; LatestRevisionDate: 2014-11-19
IC9 = TLC555ID: LinCMOS Timer; Manufacturer: TEXAS INSTRUMENTS; PressFit: No; Bonding: No; Part Number: TLC555ID; Component Kind: Standard; Component Type: Standard; Device: TLC555ID; PackageDescription: SOIC 8, Pitch 1.27mm, Body 4x5mm, IPC Medium Density; Part Description: LinCMOS Timer; Manufacturer Part Number: TLC555ID; Pin Count: 8; Case: SOIC8; Mounted: Yes; Socket: No; SMD: Yes; Sense: No; ComponentHeight: 1.75mm; Author: CERN DEM JMW; HelpURL: \\cern.ch\dfs\Applications\Altium\Datasheets\TLC555ID.pdf; CreateDate: 23.08.2016; LatestRevisionDate: 23.08.2016
J4 = AMPHENOL_10052825-101LF: 72 Contacts Header, 6 Columns, 4 Pairs per Column; Manufacturer: AMPHENOL; Part Number: 10052825-101LF
J5 = AMPHENOL_10052838-101LF: 96 Contacts Header, 8 Columns, 4 Pairs per Column; Manufacturer: AMPHENOL; Part Number: 10052838-101LF
R10 R11 R39 = R0603_33R_1%_0.1W_100PPM: Resistor - 1%; Part Description: General Purpose Thick Film Chip Resistor; Manufacturer: GENERIC; Manufacturer1 Part Number: NRC06F33R0TRF; Power: 0.1W; TC: ±100ppm/°C; PressFit: No; Part Number: R0603_33R_1%_0.1W_100PPM; Component Kind: Standard; Component Type: Standard; Pin Count: 2; Value: 33; Status: Preferred; Manufacturer Part Number: R0603_33R_1%_0.1W_100PPM; Case: 0603; Mounted: Yes; Sense: No; Socket: No; SMD: Yes; Manufacturer1 Example: NIC COMPONENT; Manufacturer1 ComponentHeight: 0.55mm; HelpURL: \\cern.ch\dfs\Applications\Altium\Datasheets\R0603_NIC_NRC.pdf; Author: CERN DEM JLC; CreateDate: 03.12.2007; LatestRevisionDate: 13.03.2008
R36 R46 = Resistor - 1%
R48 = R0402_200R_1%_0.0625W_100PPM: Resistor - 1%; Part Description: General Purpose Thick Film Chip Resistor; Manufacturer: GENERIC; Manufacturer1 Part Number: 232270672001L; TC: ±100ppm/°C; PressFit: No; Part Number: R0402_200R_1%_0.0625W_100PPM; Component Kind: Standard; Component Type: Standard; Pin Count: 2; Value: 200; Status: Not Recommended; Power: 0.0625W; Tolerance: ±1%; Manufacturer Part Number: R0402_200R_1%_0.0625W_100PPM; Case: 0402; Mounted: Yes; Sense: No; Socket: No; SMD: Yes; Manufacturer1 Example: YAGEO PHYCOMP; Manufacturer1 ComponentHeight: 0.4mm; HelpURL: \\cern.ch\dfs\Applications\Altium\Datasheets\R0402_Phycomp_RC0402.pdf; Author: CERN DEM JLC; CreateDate: 2007-12-03; LatestRevisionDate: 2012-10-17
R50-R54 R60 R64 R71 = R0402_10K_1%_0.0625W_100PPM: as R1 on sheet Grabber_DIOT; Part Number: R0402_10K_1%_0.0625W_100PPM; Component Kind: Standard; Component Type: Standard; Pin Count: 2; Value: 10k; Status: Not recommended; Power: 0.0625W; Tolerance: ±1%; Manufacturer Part Number: R0402_10K_1%_0.0625W_100PPM; Case: 0402; Mounted: Yes; Sense: No; Socket: No; SMD: Yes; Manufacturer1 Example: YAGEO PHYCOMP; Manufacturer1 ComponentHeight: 0.4mm; HelpURL: \\cern.ch\dfs\Applications\Altium\Datasheets\R0402_Phycomp_RC0402.pdf; Author: CERN DEM JLC; CreateDate: 03.12.2007; LatestRevisionDate: 17.10.2012
R55 R62 = R0603_2K7_1%_0.1W_100PPM: Resistor - 1%; Part Description: General Purpose Thick Film Chip Resistor; Manufacturer: GENERIC; Manufacturer1 Part Number: RC0603FR-072K7L; Power: 0.1W; TC: ±100ppm/°C; PressFit: No; Part Number: R0603_2K7_1%_0.1W_100PPM; Component Kind: Standard; Component Type: Standard; Pin Count: 2; Value: 2k7; Status: Preferred; Manufacturer Part Number: R0603_2K7_1%_0.1W_100PPM; Case: 0603; Mounted: Yes; Sense: No; Socket: No; SMD: Yes; Manufacturer1 Example: YAGEO PHYCOMP; Manufacturer1 ComponentHeight: 0.55mm; HelpURL: \\cern.ch\dfs\Applications\Altium\Datasheets\R0603_PHYCOMP_RC0603.pdf; Author: CERN DEM JLC; CreateDate: 02.05.2011; LatestRevisionDate: 02.05.2011
R61 R63 = R0402_0R_JUMPER: Resistor; Part Description: 1A (0.05R Max DC Resistance) Zero Ohm Jumper; Manufacturer: GENERIC; Manufacturer1 Part Number: 232270591001L; Part Number: R0402_0R_JUMPER; Component Kind: Standard; Component Type: Standard; Footprint: RESC1005X40N; Pin Count: 2; Value: 0; Status: Not recommended; Manufacturer Part Number: R0402_0R_JUMPER; Case: 0402; Mounted: Yes; Sense: No; Socket: No; SMD: Yes; Manufacturer1 Example: YAGEO PHYCOMP; Manufacturer1 ComponentHeight: 0.4mm; HelpURL: \\cern.ch\dfs\Applications\Altium\Datasheets\R0402_Phycomp_RC0402.pdf; Author: CERN DEM JLC; CreateDate: 03.12.2007; LatestRevisionDate: 17.10.2012
T1-T4 = BSS138LT1G: N-CHANNEL MOSFET WITH DIODE; Part Description: 50V, 200mA N-Channel Enhancement Mode Field-Effect Transistor; Manufacturer: ON SEMICONDUCTOR; PressFit: No; Bonding: No; Part Number: BSS138LT1G; Component Kind: Standard; Component Type: Standard; Device: BSS138LT1G; PackageDescription: SOT23, 0.95mm Pitch; 3 Pin, 1.40mm W X 3.00mm L X 1.10mm H body, IPC Medium Density; Manufacturer Part Number: BSS138L; Pin Count: 3; Case: SOT23-3; Mounted: Yes; Socket: No; SMD: Yes; Sense: No; ComponentHeight: 1.11mm; HelpURL: \\cern.ch\dfs\Applications\Altium\Datasheets\BSS138LT1G.pdf; Author: CERN DEM JLC; CreateDate: 23.03.2009; LatestRevisionDate: 25.05.2022